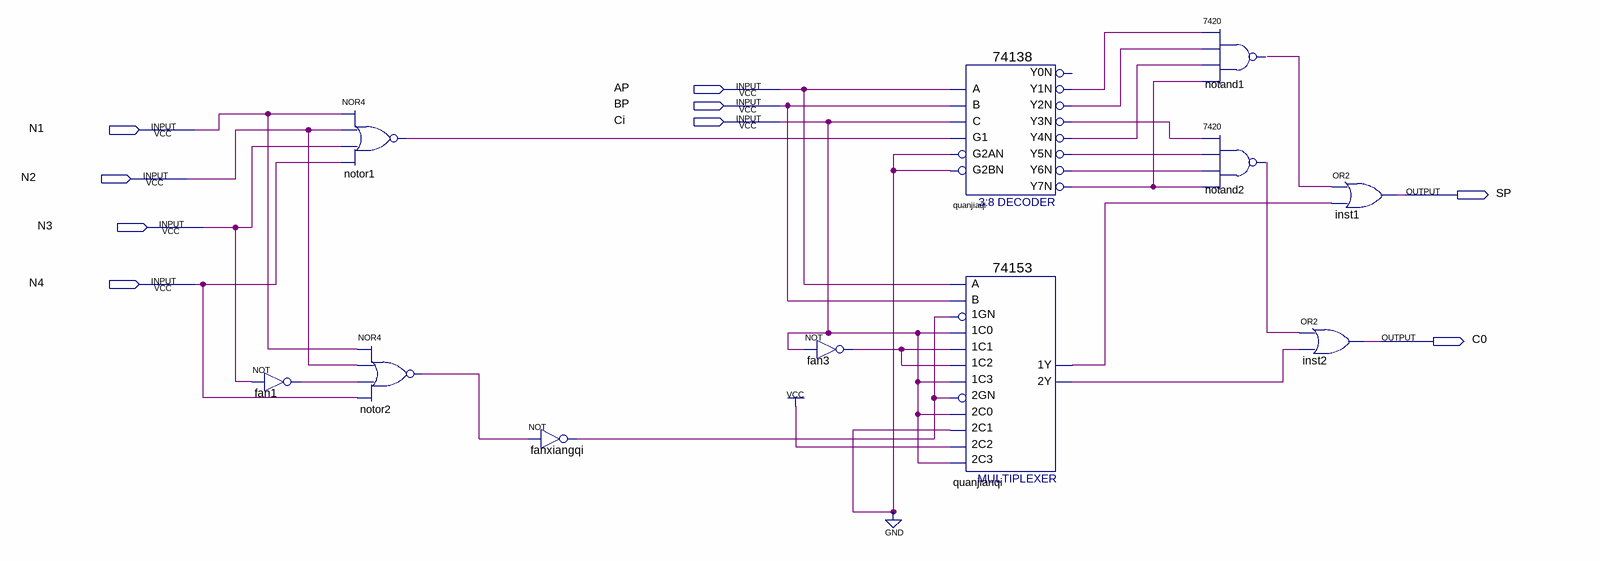
[diagram p0: schematic sheet]
// Quartus schematic sdsy.bdf as structural Verilog: 11 symbols, 9 pins
module sdsy (
  input  AP,
  input  BP,
  input  Ci,
  input  N1,
  input  N2,
  input  N3,
  input  N4,
  output SP,
  output C0
);

  wire fan1_out, fan3_out, fanxiangqi_out, notand1_1, notand2_1, notor1_out, notor2_out, quanjianqi_1y,
       quanjianqi_2y, quanjiaqi_y1n, quanjiaqi_y2n, quanjiaqi_y3n, quanjiaqi_y4n, quanjiaqi_y5n,
       quanjiaqi_y6n, quanjiaqi_y7n;

  not fan1 (fan1_out, N3);
  nor notor1 (notor1_out, N1, N2, N3, N4);
  nor notor2 (notor2_out, N1, N2, fan1_out, N4);
  not fanxiangqi (fanxiangqi_out, notor2_out);
  not fan3 (fan3_out, Ci);
  \74138  quanjiaqi (
    .A(AP), .B(BP), .G1(notor1_out), .C(Ci), .G2AN(1'b0), .G2BN(1'b0), .Y1N(quanjiaqi_y1n),
    .Y2N(quanjiaqi_y2n), .Y3N(quanjiaqi_y3n), .Y4N(quanjiaqi_y4n), .Y5N(quanjiaqi_y5n), .Y6N(quanjiaqi_y6n),
    .Y7N(quanjiaqi_y7n));  // open: Y0N
  \74153  quanjianqi (
    .\1C1 (fan3_out), .\1GN (fanxiangqi_out), .\1C0 (Ci), .\2C0 (Ci), .\2GN (fanxiangqi_out), .\2C2 (1'b1),
    .\1C2 (fan3_out), .\1C3 (Ci), .B(BP), .A(AP), .\2C1 (1'b0), .\2C3 (Ci), .\1Y (quanjianqi_1y),
    .\2Y (quanjianqi_2y));
  \7420  notand1 (.\4 (quanjiaqi_y4n), .\2 (quanjiaqi_y1n), .\3 (quanjiaqi_y2n), .\5 (quanjiaqi_y7n), .\1 (notand1_1));
  \7420  notand2 (.\4 (quanjiaqi_y6n), .\2 (quanjiaqi_y3n), .\3 (quanjiaqi_y5n), .\5 (quanjiaqi_y7n), .\1 (notand2_1));
  or inst2 (C0, notand2_1, quanjianqi_2y);
  or inst1 (SP, notand1_1, quanjianqi_1y);
endmodule
